# Altium schematic sheet HDx_Interface.SchDoc
size A4; SheetNumber: 4; SheetTotal: 5
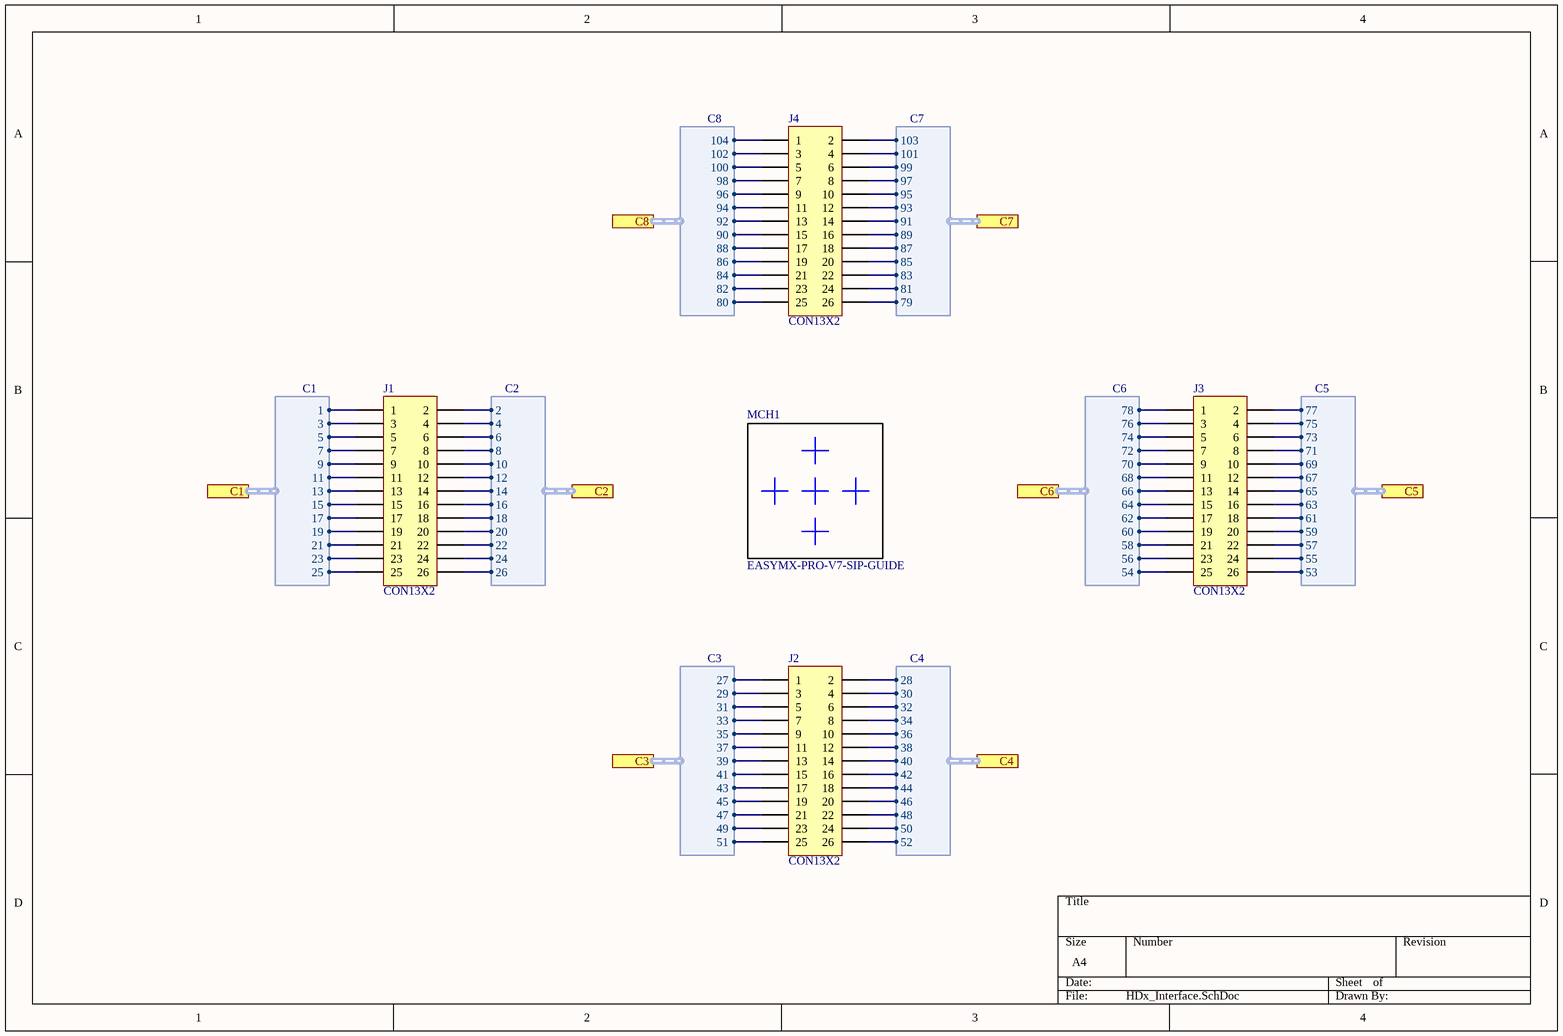
[diagram p0: HDx_Interface.SchDoc]

## Parts
J1  CON13X2  [SIP13X2]
J2  CON13X2  [SIP13X2]
J3  CON13X2  [SIP13X2]
J4  CON13X2  [SIP13X2]
MCH1  EASYMX-PRO-V7-SIP-GUIDE  [EASYMX-PRO-V7-MCH-GUIDE]  (no BOM)

## Ports
C1 (harness C1, see MCU_Board_top[3B], HDx_Mapping[6A]), C2 (harness C2, see MCU_Board_top[3B], HDx_Mapping[7A]), C3 (harness C3, see MCU_Board_top[3B], HDx_Mapping[6B]), C4 (harness C4, see MCU_Board_top[3B], HDx_Mapping[7B]), C5 (harness C5, see MCU_Board_top[3B], HDx_Mapping[6C]), C6 (harness C6, see MCU_Board_top[3B], HDx_Mapping[7C]), C7 (harness C7, see MCU_Board_top[3C], HDx_Mapping[6C]), C8 (harness C8, see MCU_Board_top[3C], HDx_Mapping[7C])

## Harnesses
C1: 1, 3, 5, 7, 9, 11, 13, 15, 17, 19, 21, 23, 25
C2: 2, 4, 6, 8, 10, 12, 14, 16, 18, 20, 22, 24, 26
C3: 27, 29, 31, 33, 35, 37, 39, 41, 43, 45, 47, 49, 51
C4: 28, 30, 32, 34, 36, 38, 40, 42, 44, 46, 48, 50, 52
C6: 54, 56, 58, 60, 62, 64, 66, 68, 70, 72, 74, 76, 78
C5: 53, 55, 57, 59, 61, 63, 65, 67, 69, 71, 73, 75, 77
C8: 80, 82, 84, 86, 88, 90, 92, 94, 96, 98, 100, 102, 104
C7: 79, 81, 83, 85, 87, 89, 91, 93, 95, 97, 99, 101, 103

## Nets
NetJ1_1: J1.1 ; port C1.1
NetJ1_2: J1.2 ; port C2.2
NetJ1_3: J1.3 ; port C1.3
NetJ1_4: J1.4 ; port C2.4
NetJ1_5: J1.5 ; port C1.5
NetJ1_6: J1.6 ; port C2.6
NetJ1_7: J1.7 ; port C1.7
NetJ1_8: J1.8 ; port C2.8
NetJ1_9: J1.9 ; port C1.9
NetJ1_10: J1.10 ; port C2.10
NetJ1_11: J1.11 ; port C1.11
NetJ1_12: J1.12 ; port C2.12
NetJ1_13: J1.13 ; port C1.13
NetJ1_14: J1.14 ; port C2.14
NetJ1_15: J1.15 ; port C1.15
NetJ1_16: J1.16 ; port C2.16
NetJ1_17: J1.17 ; port C1.17
NetJ1_18: J1.18 ; port C2.18
NetJ1_19: J1.19 ; port C1.19
NetJ1_20: J1.20 ; port C2.20
NetJ1_21: J1.21 ; port C1.21
NetJ1_22: J1.22 ; port C2.22
NetJ1_23: J1.23 ; port C1.23
NetJ1_24: J1.24 ; port C2.24
NetJ1_25: J1.25 ; port C1.25
NetJ1_26: J1.26 ; port C2.26
NetJ2_1: J2.1 ; port C3.27
NetJ2_2: J2.2 ; port C4.28
NetJ2_3: J2.3 ; port C3.29
NetJ2_4: J2.4 ; port C4.30
NetJ2_5: J2.5 ; port C3.31
NetJ2_6: J2.6 ; port C4.32
NetJ2_7: J2.7 ; port C3.33
NetJ2_8: J2.8 ; port C4.34
NetJ2_9: J2.9 ; port C3.35
NetJ2_10: J2.10 ; port C4.36
NetJ2_11: J2.11 ; port C3.37
NetJ2_12: J2.12 ; port C4.38
NetJ2_13: J2.13 ; port C3.39
NetJ2_14: J2.14 ; port C4.40
NetJ2_15: J2.15 ; port C3.41
NetJ2_16: J2.16 ; port C4.42
NetJ2_17: J2.17 ; port C3.43
NetJ2_18: J2.18 ; port C4.44
NetJ2_19: J2.19 ; port C3.45
NetJ2_20: J2.20 ; port C4.46
NetJ2_21: J2.21 ; port C3.47
NetJ2_22: J2.22 ; port C4.48
NetJ2_23: J2.23 ; port C3.49
NetJ2_24: J2.24 ; port C4.50
NetJ2_25: J2.25 ; port C3.51
NetJ2_26: J2.26 ; port C4.52
NetJ3_1: J3.1 ; port C6.78
NetJ3_2: J3.2 ; port C5.77
NetJ3_3: J3.3 ; port C6.76
NetJ3_4: J3.4 ; port C5.75
NetJ3_5: J3.5 ; port C6.74
NetJ3_6: J3.6 ; port C5.73
NetJ3_7: J3.7 ; port C6.72
NetJ3_8: J3.8 ; port C5.71
NetJ3_9: J3.9 ; port C6.70
NetJ3_10: J3.10 ; port C5.69
NetJ3_11: J3.11 ; port C6.68
NetJ3_12: J3.12 ; port C5.67
NetJ3_13: J3.13 ; port C6.66
NetJ3_14: J3.14 ; port C5.65
NetJ3_15: J3.15 ; port C6.64
NetJ3_16: J3.16 ; port C5.63
NetJ3_17: J3.17 ; port C6.62
NetJ3_18: J3.18 ; port C5.61
NetJ3_19: J3.19 ; port C6.60
NetJ3_20: J3.20 ; port C5.59
NetJ3_21: J3.21 ; port C6.58
NetJ3_22: J3.22 ; port C5.57
NetJ3_23: J3.23 ; port C6.56
NetJ3_24: J3.24 ; port C5.55
NetJ3_25: J3.25 ; port C6.54
NetJ3_26: J3.26 ; port C5.53
NetJ4_1: J4.1 ; port C8.104
NetJ4_2: J4.2 ; port C7.103
NetJ4_3: J4.3 ; port C8.102
NetJ4_4: J4.4 ; port C7.101
NetJ4_5: J4.5 ; port C8.100
NetJ4_6: J4.6 ; port C7.99
NetJ4_7: J4.7 ; port C8.98
NetJ4_8: J4.8 ; port C7.97
NetJ4_9: J4.9 ; port C8.96
NetJ4_10: J4.10 ; port C7.95
NetJ4_11: J4.11 ; port C8.94
NetJ4_12: J4.12 ; port C7.93
NetJ4_13: J4.13 ; port C8.92
NetJ4_14: J4.14 ; port C7.91
NetJ4_15: J4.15 ; port C8.90
NetJ4_16: J4.16 ; port C7.89
NetJ4_17: J4.17 ; port C8.88
NetJ4_18: J4.18 ; port C7.87
NetJ4_19: J4.19 ; port C8.86
NetJ4_20: J4.20 ; port C7.85
NetJ4_21: J4.21 ; port C8.84
NetJ4_22: J4.22 ; port C7.83
NetJ4_23: J4.23 ; port C8.82
NetJ4_24: J4.24 ; port C7.81
NetJ4_25: J4.25 ; port C8.80
NetJ4_26: J4.26 ; port C7.79

## Library data of the parts
MCH1 = EASYMX-PRO-V7-SIP-GUIDE: EasyMx Pro V7 mechanical centers for SIP connectors